# Altium schematic sheet sudoku.SchDoc
size 999 x 540 mm
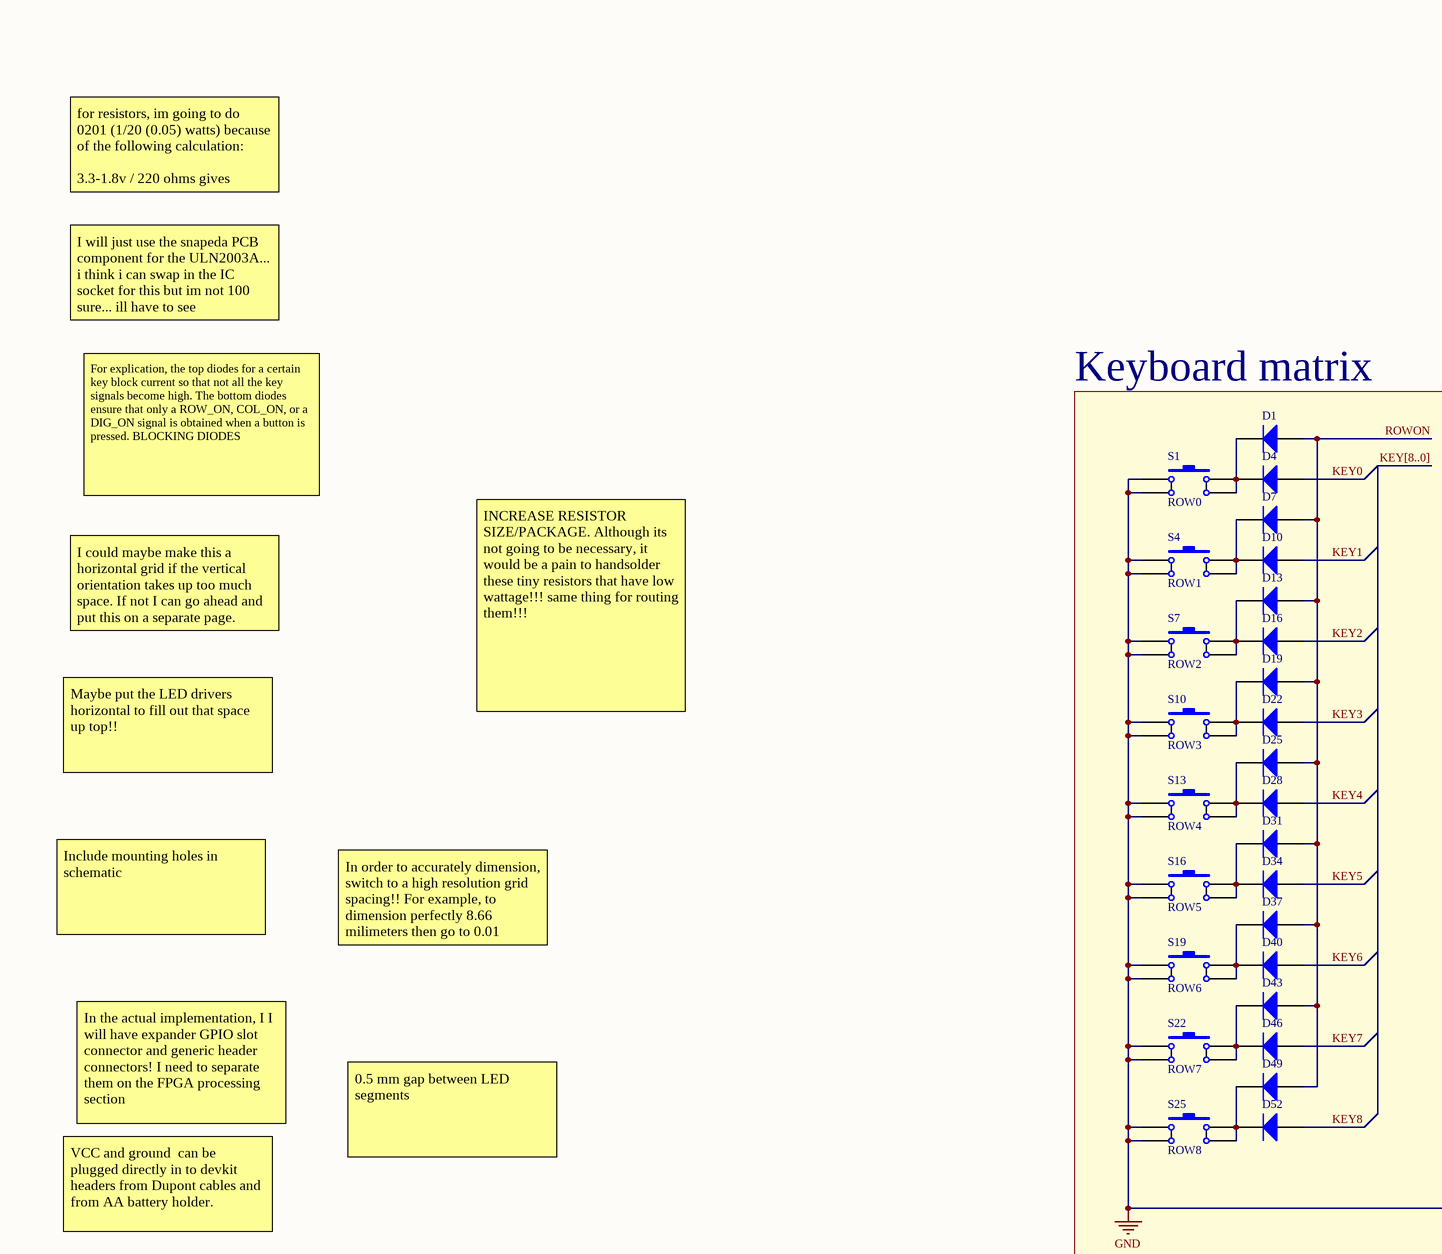
[diagram p0: sudoku.SchDoc, top left]
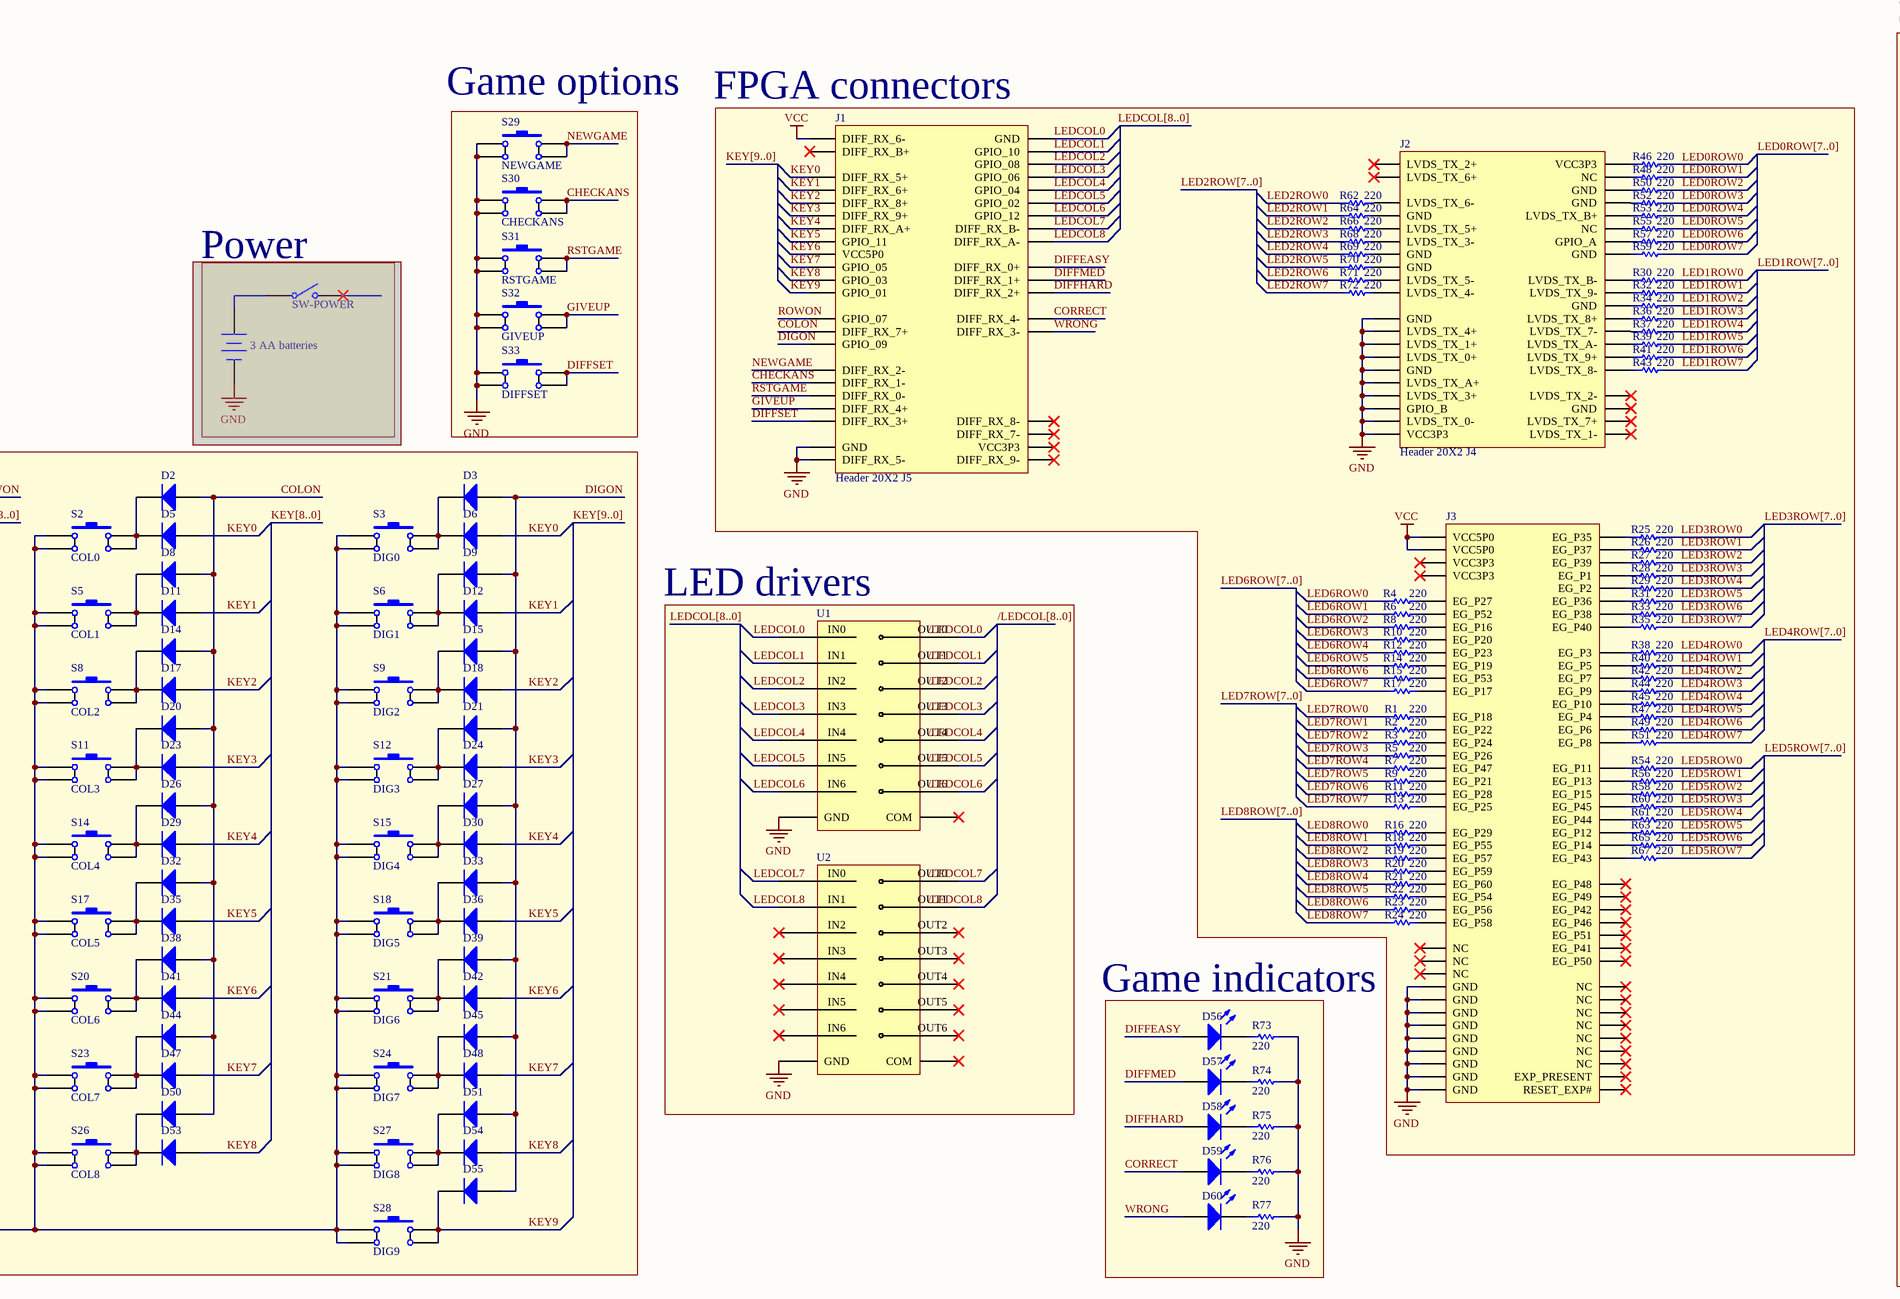
[diagram p1: sudoku.SchDoc, top middle]
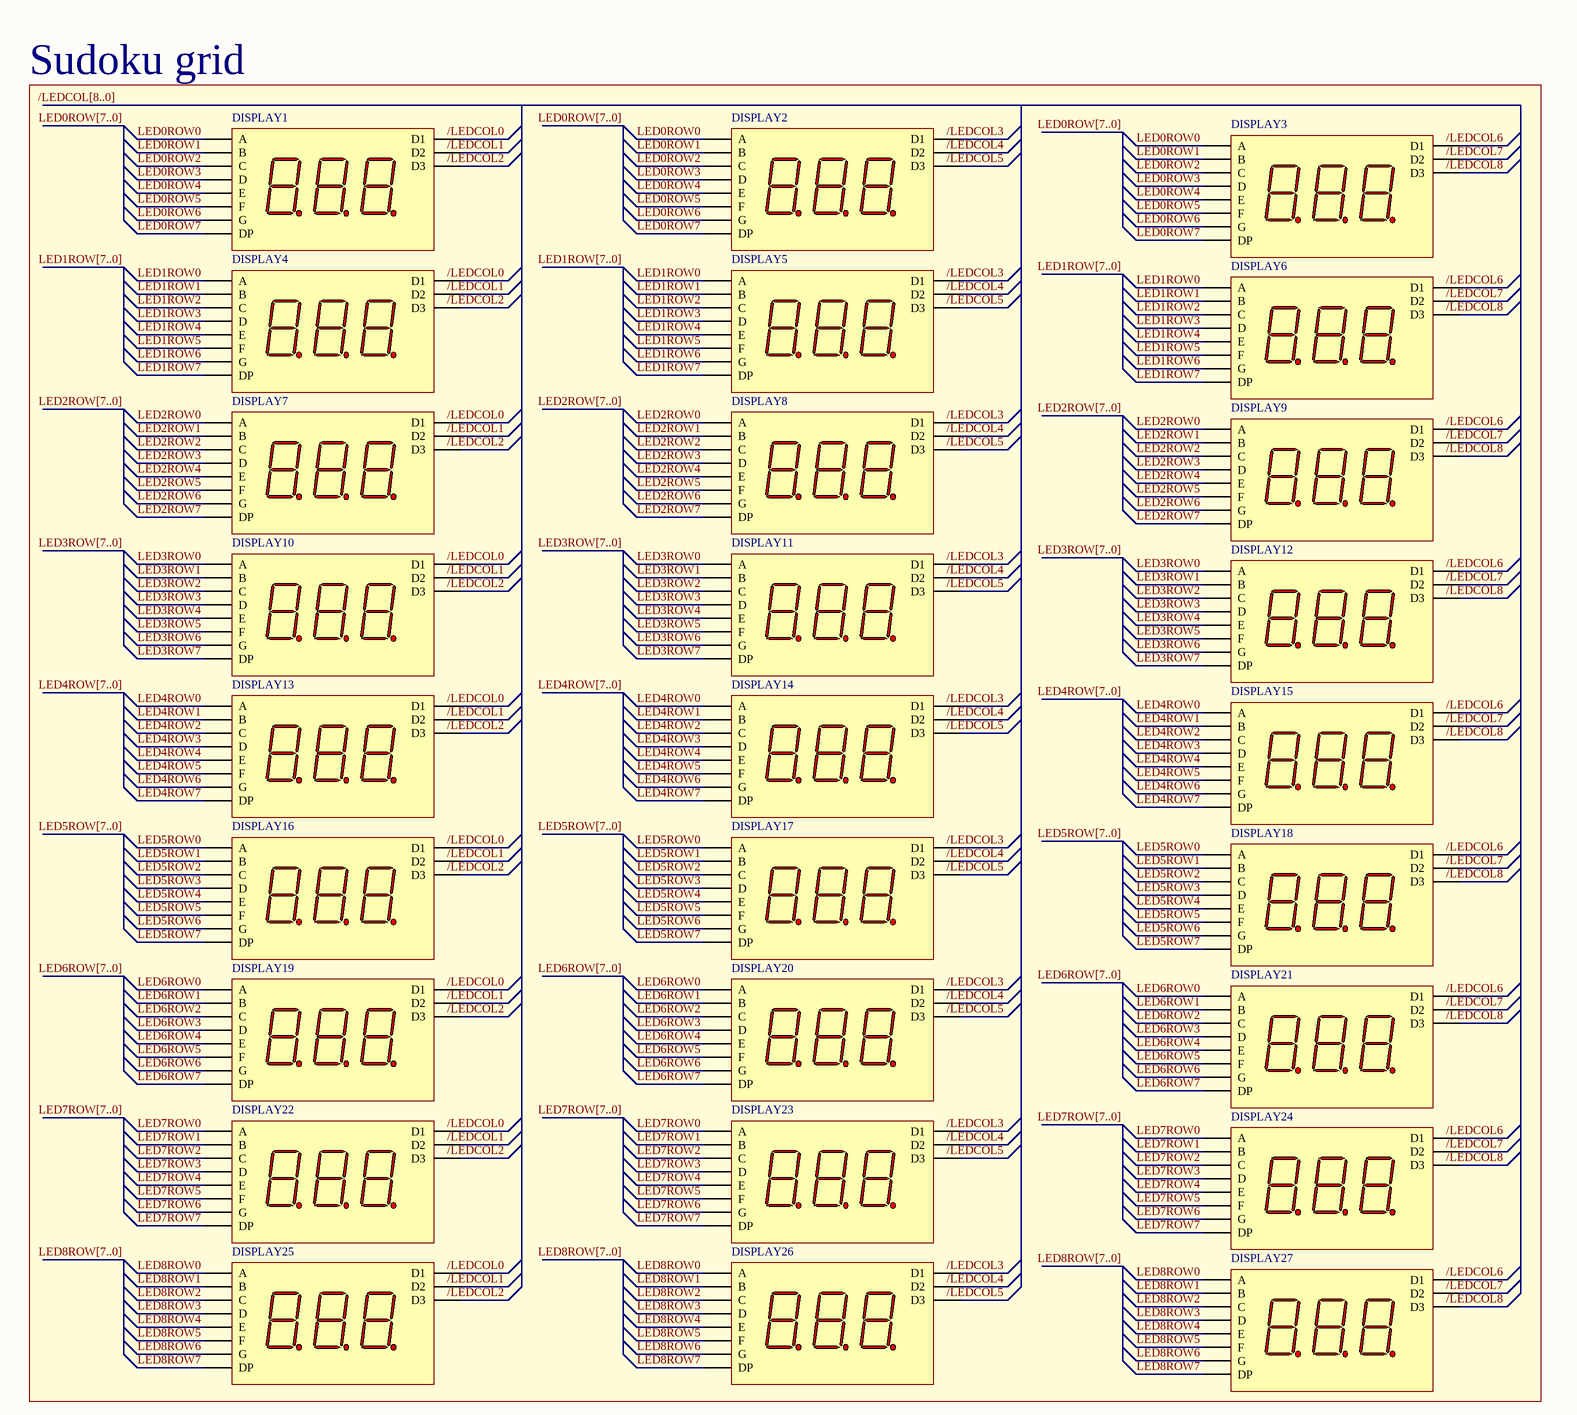
[diagram p2: sudoku.SchDoc, top right]
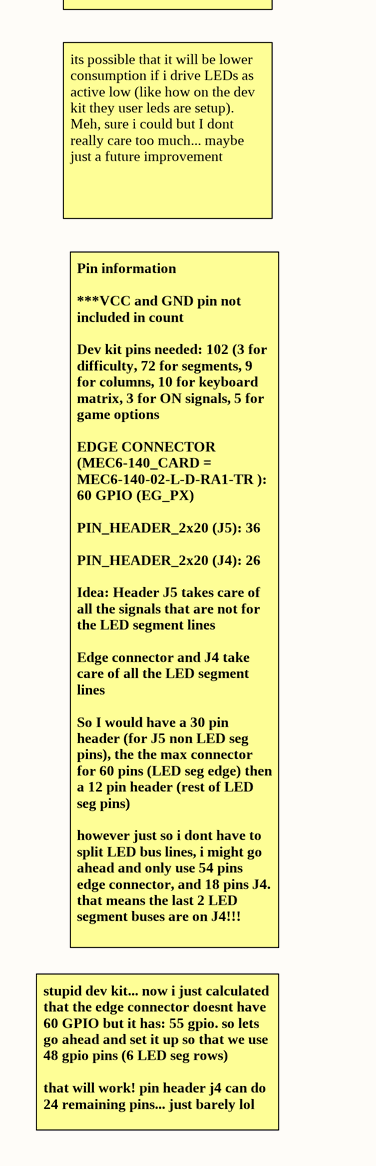
[diagram p3: sudoku.SchDoc, bottom left]
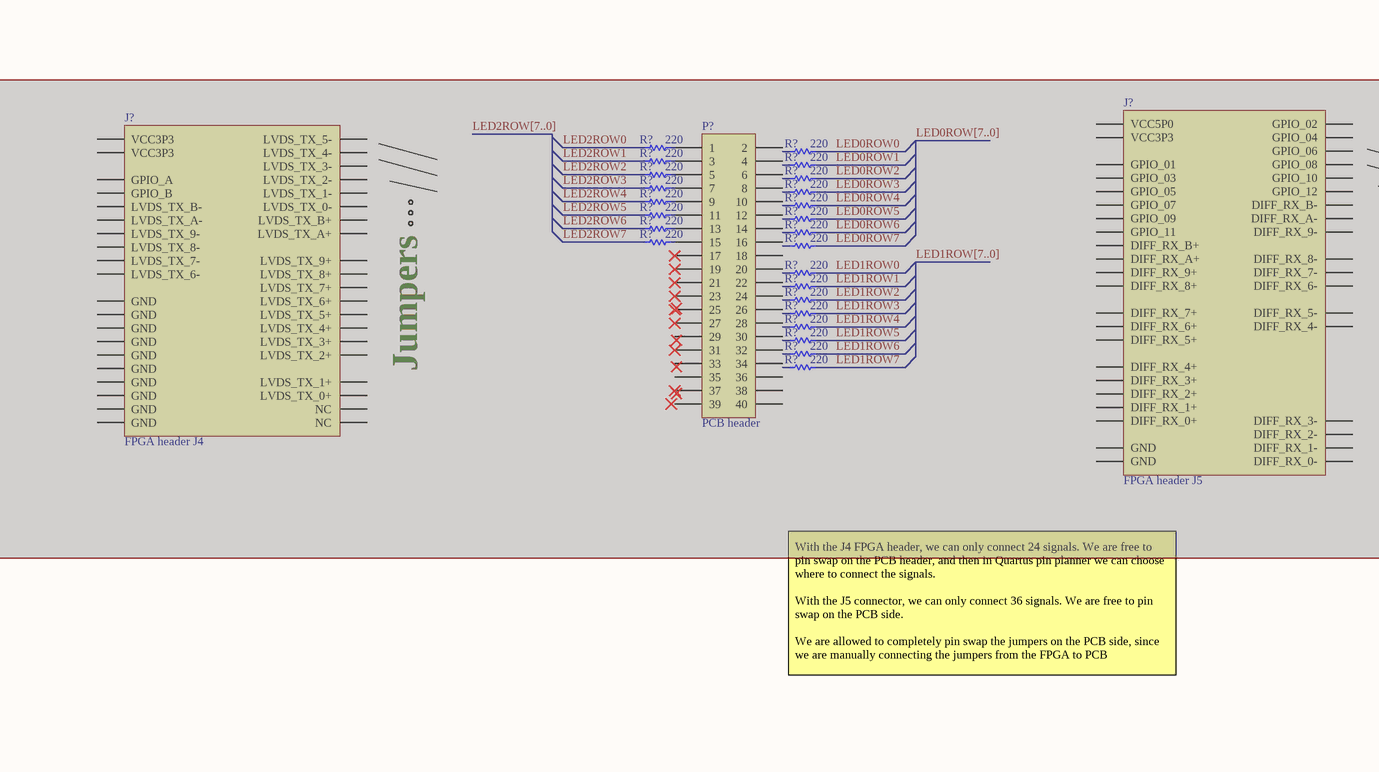
[diagram p4: sudoku.SchDoc, bottom middle]
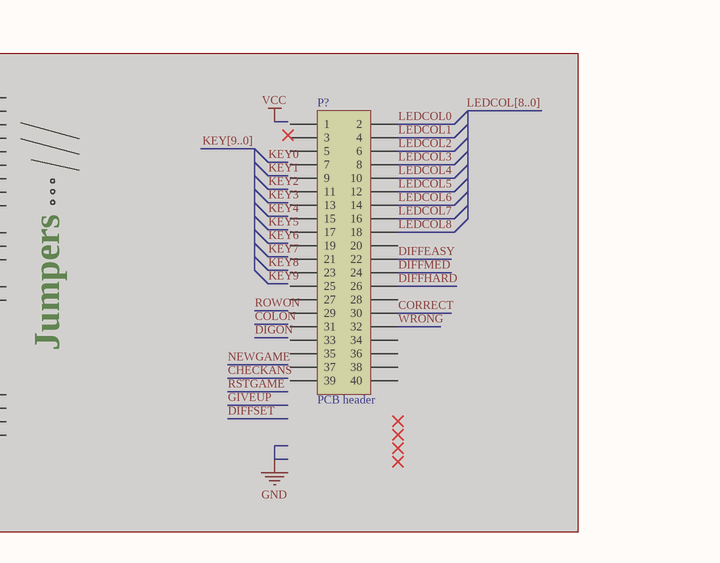
[diagram p5: sudoku.SchDoc, bottom right]

## Parts
(Parts that share a designator on the sheet are numbered #1, #2 ... from top to bottom, then left to right.)
BT?  3 AA batteries  [BAT-2]  (masked out: inside a compile mask, not in the netlist)
D1  Diode 1N4007  [DIODE_SMC]  (value not drawn)
D2  Diode 1N4007  [DIODE_SMC]  (value not drawn)
D3  Diode 1N4007  [DIODE_SMC]  (value not drawn)
D4  Diode 1N4007  [DIODE_SMC]  (value not drawn)
D5  Diode 1N4007  [DIODE_SMC]  (value not drawn)
D6  Diode 1N4007  [DIODE_SMC]  (value not drawn)
D7  Diode 1N4007  [DIODE_SMC]  (value not drawn)
D8  Diode 1N4007  [DIODE_SMC]  (value not drawn)
D9  Diode 1N4007  [DIODE_SMC]  (value not drawn)
D10  Diode 1N4007  [DIODE_SMC]  (value not drawn)
D11  Diode 1N4007  [DIODE_SMC]  (value not drawn)
D12  Diode 1N4007  [DIODE_SMC]  (value not drawn)
D13  Diode 1N4007  [DIODE_SMC]  (value not drawn)
D14  Diode 1N4007  [DIODE_SMC]  (value not drawn)
D15  Diode 1N4007  [DIODE_SMC]  (value not drawn)
D16  Diode 1N4007  [DIODE_SMC]  (value not drawn)
D17  Diode 1N4007  [DIODE_SMC]  (value not drawn)
D18  Diode 1N4007  [DIODE_SMC]  (value not drawn)
D19  Diode 1N4007  [DIODE_SMC]  (value not drawn)
D20  Diode 1N4007  [DIODE_SMC]  (value not drawn)
D21  Diode 1N4007  [DIODE_SMC]  (value not drawn)
D22  Diode 1N4007  [DIODE_SMC]  (value not drawn)
D23  Diode 1N4007  [DIODE_SMC]  (value not drawn)
D24  Diode 1N4007  [DIODE_SMC]  (value not drawn)
D25  Diode 1N4007  [DIODE_SMC]  (value not drawn)
D26  Diode 1N4007  [DIODE_SMC]  (value not drawn)
D27  Diode 1N4007  [DIODE_SMC]  (value not drawn)
D28  Diode 1N4007  [DIODE_SMC]  (value not drawn)
D29  Diode 1N4007  [DIODE_SMC]  (value not drawn)
D30  Diode 1N4007  [DIODE_SMC]  (value not drawn)
D31  Diode 1N4007  [DIODE_SMC]  (value not drawn)
D32  Diode 1N4007  [DIODE_SMC]  (value not drawn)
D33  Diode 1N4007  [DIODE_SMC]  (value not drawn)
D34  Diode 1N4007  [DIODE_SMC]  (value not drawn)
D35  Diode 1N4007  [DIODE_SMC]  (value not drawn)
D36  Diode 1N4007  [DIODE_SMC]  (value not drawn)
D37  Diode 1N4007  [DIODE_SMC]  (value not drawn)
D38  Diode 1N4007  [DIODE_SMC]  (value not drawn)
D39  Diode 1N4007  [DIODE_SMC]  (value not drawn)
D40  Diode 1N4007  [DIODE_SMC]  (value not drawn)
D41  Diode 1N4007  [DIODE_SMC]  (value not drawn)
D42  Diode 1N4007  [DIODE_SMC]  (value not drawn)
D43  Diode 1N4007  [DIODE_SMC]  (value not drawn)
D44  Diode 1N4007  [DIODE_SMC]  (value not drawn)
D45  Diode 1N4007  [DIODE_SMC]  (value not drawn)
D46  Diode 1N4007  [DIODE_SMC]  (value not drawn)
D47  Diode 1N4007  [DIODE_SMC]  (value not drawn)
D48  Diode 1N4007  [DIODE_SMC]  (value not drawn)
D49  Diode 1N4007  [DIODE_SMC]  (value not drawn)
D50  Diode 1N4007  [DIODE_SMC]  (value not drawn)
D51  Diode 1N4007  [DIODE_SMC]  (value not drawn)
D52  Diode 1N4007  [DIODE_SMC]  (value not drawn)
D53  Diode 1N4007  [DIODE_SMC]  (value not drawn)
D54  Diode 1N4007  [DIODE_SMC]  (value not drawn)
D55  Diode 1N4007  [DIODE_SMC]  (value not drawn)
D56  LED1  [RED]  (value not drawn)
D57  LED1  [RED]  (value not drawn)
D58  LED1  [RED]  (value not drawn)
D59  LED1  [green]  (value not drawn)
D60  LED1  [RED]  (value not drawn)
DISPLAY1  (no value)  [3DIGITDISPLAY]
DISPLAY2  (no value)  [3DIGITDISPLAY]
DISPLAY3  (no value)  [3DIGITDISPLAY]
DISPLAY4  (no value)  [3DIGITDISPLAY]
DISPLAY5  (no value)  [3DIGITDISPLAY]
DISPLAY6  (no value)  [3DIGITDISPLAY]
DISPLAY7  (no value)  [3DIGITDISPLAY]
DISPLAY8  (no value)  [3DIGITDISPLAY]
DISPLAY9  (no value)  [3DIGITDISPLAY]
DISPLAY10  (no value)  [3DIGITDISPLAY]
DISPLAY11  (no value)  [3DIGITDISPLAY]
DISPLAY12  (no value)  [3DIGITDISPLAY]
DISPLAY13  (no value)  [3DIGITDISPLAY]
DISPLAY14  (no value)  [3DIGITDISPLAY]
DISPLAY15  (no value)  [3DIGITDISPLAY]
DISPLAY16  (no value)  [3DIGITDISPLAY]
DISPLAY17  (no value)  [3DIGITDISPLAY]
DISPLAY18  (no value)  [3DIGITDISPLAY]
DISPLAY19  (no value)  [3DIGITDISPLAY]
DISPLAY20  (no value)  [3DIGITDISPLAY]
DISPLAY21  (no value)  [3DIGITDISPLAY]
DISPLAY22  (no value)  [3DIGITDISPLAY]
DISPLAY23  (no value)  [3DIGITDISPLAY]
DISPLAY24  (no value)  [3DIGITDISPLAY]
DISPLAY25  (no value)  [3DIGITDISPLAY]
DISPLAY26  (no value)  [3DIGITDISPLAY]
DISPLAY27  (no value)  [3DIGITDISPLAY]
J1  Header 20X2 J5  [2x20]
J2  Header 20X2 J4  [2x20]
J3  (no value)  [SAMTEC_MEC6-140-02-L-D-RA1-TR]
J?#1  FPGA header J4  [2x20]  (masked out: inside a compile mask, not in the netlist)
J?#2  FPGA header J5  [2x20]  (masked out: inside a compile mask, not in the netlist)
P?#1  PCB header  [HDR2X20]  (masked out: inside a compile mask, not in the netlist)
P?#2  PCB header  [HDR2X20]  (masked out: inside a compile mask, not in the netlist)
R1  value 220  [SMD-0805-RES]  (hidden comment: Res1)
R2  value 220  [SMD-0805-RES]  (hidden comment: Res1)
R3  value 220  [SMD-0805-RES]  (hidden comment: Res1)
R4  value 220  [SMD-0805-RES]  (hidden comment: Res1)
R5  value 220  [SMD-0805-RES]  (hidden comment: Res1)
R6  value 220  [SMD-0805-RES]  (hidden comment: Res1)
R7  value 220  [SMD-0805-RES]  (hidden comment: Res1)
R8  value 220  [SMD-0805-RES]  (hidden comment: Res1)
R9  value 220  [SMD-0805-RES]  (hidden comment: Res1)
R10  value 220  [SMD-0805-RES]  (hidden comment: Res1)
R11  value 220  [SMD-0805-RES]  (hidden comment: Res1)
R12  value 220  [SMD-0805-RES]  (hidden comment: Res1)
R13  value 220  [SMD-0805-RES]  (hidden comment: Res1)
R14  value 220  [SMD-0805-RES]  (hidden comment: Res1)
R15  value 220  [SMD-0805-RES]  (hidden comment: Res1)
R16  value 220  [SMD-0805-RES]  (hidden comment: Res1)
R17  value 220  [SMD-0805-RES]  (hidden comment: Res1)
R18  value 220  [SMD-0805-RES]  (hidden comment: Res1)
R19  value 220  [SMD-0805-RES]  (hidden comment: Res1)
R20  value 220  [SMD-0805-RES]  (hidden comment: Res1)
R21  value 220  [SMD-0805-RES]  (hidden comment: Res1)
R22  value 220  [SMD-0805-RES]  (hidden comment: Res1)
R23  value 220  [SMD-0805-RES]  (hidden comment: Res1)
R24  value 220  [SMD-0805-RES]  (hidden comment: Res1)
R25  value 220  [SMD-0805-RES]  (hidden comment: Res1)
R26  value 220  [SMD-0805-RES]  (hidden comment: Res1)
R27  value 220  [SMD-0805-RES]  (hidden comment: Res1)
R28  value 220  [SMD-0805-RES]  (hidden comment: Res1)
R29  value 220  [SMD-0805-RES]  (hidden comment: Res1)
R30  value 220  [SMD-0805-RES]  (hidden comment: Res1)
R31  value 220  [SMD-0805-RES]  (hidden comment: Res1)
R32  value 220  [SMD-0805-RES]  (hidden comment: Res1)
R33  value 220  [SMD-0805-RES]  (hidden comment: Res1)
R34  value 220  [SMD-0805-RES]  (hidden comment: Res1)
R35  value 220  [SMD-0805-RES]  (hidden comment: Res1)
R36  value 220  [SMD-0805-RES]  (hidden comment: Res1)
R37  value 220  [SMD-0805-RES]  (hidden comment: Res1)
R38  value 220  [SMD-0805-RES]  (hidden comment: Res1)
R39  value 220  [SMD-0805-RES]  (hidden comment: Res1)
R40  value 220  [SMD-0805-RES]  (hidden comment: Res1)
R41  value 220  [SMD-0805-RES]  (hidden comment: Res1)
R42  value 220  [SMD-0805-RES]  (hidden comment: Res1)
R43  value 220  [SMD-0805-RES]  (hidden comment: Res1)
R44  value 220  [SMD-0805-RES]  (hidden comment: Res1)
R45  value 220  [SMD-0805-RES]  (hidden comment: Res1)
R46  value 220  [SMD-0805-RES]  (hidden comment: Res1)
R47  value 220  [SMD-0805-RES]  (hidden comment: Res1)
R48  value 220  [SMD-0805-RES]  (hidden comment: Res1)
R49  value 220  [SMD-0805-RES]  (hidden comment: Res1)
R50  value 220  [SMD-0805-RES]  (hidden comment: Res1)
R51  value 220  [SMD-0805-RES]  (hidden comment: Res1)
R52  value 220  [SMD-0805-RES]  (hidden comment: Res1)
R53  value 220  [SMD-0805-RES]  (hidden comment: Res1)
R54  value 220  [SMD-0805-RES]  (hidden comment: Res1)
R55  value 220  [SMD-0805-RES]  (hidden comment: Res1)
R56  value 220  [SMD-0805-RES]  (hidden comment: Res1)
R57  value 220  [SMD-0805-RES]  (hidden comment: Res1)
R58  value 220  [SMD-0805-RES]  (hidden comment: Res1)
R59  value 220  [SMD-0805-RES]  (hidden comment: Res1)
R60  value 220  [SMD-0805-RES]  (hidden comment: Res1)
R61  value 220  [SMD-0805-RES]  (hidden comment: Res1)
R62  value 220  [SMD-0805-RES]  (hidden comment: Res1)
R63  value 220  [SMD-0805-RES]  (hidden comment: Res1)
R64  value 220  [SMD-0805-RES]  (hidden comment: Res1)
R65  value 220  [SMD-0805-RES]  (hidden comment: Res1)
R66  value 220  [SMD-0805-RES]  (hidden comment: Res1)
R67  value 220  [SMD-0805-RES]  (hidden comment: Res1)
R68  value 220  [SMD-0805-RES]  (hidden comment: Res1)
R69  value 220  [SMD-0805-RES]  (hidden comment: Res1)
R70  value 220  [SMD-0805-RES]  (hidden comment: Res1)
R71  value 220  [SMD-0805-RES]  (hidden comment: Res1)
R72  value 220  [SMD-0805-RES]  (hidden comment: Res1)
R73  value 220  [SMD-0805-RES]  (hidden comment: Res1)
R74  value 220  [SMD-0805-RES]  (hidden comment: Res1)
R75  value 220  [SMD-0805-RES]  (hidden comment: Res1)
R76  value 220  [SMD-0805-RES]  (hidden comment: Res1)
R77  value 220  [SMD-0805-RES]  (hidden comment: Res1)
R?#1  value 220  [SMD-0805-RES]  (hidden comment: Res1)  (masked out: inside a compile mask, not in the netlist)
R?#2  value 220  [SMD-0805-RES]  (hidden comment: Res1)  (masked out: inside a compile mask, not in the netlist)
R?#3  value 220  [SMD-0805-RES]  (hidden comment: Res1)  (masked out: inside a compile mask, not in the netlist)
R?#4  value 220  [SMD-0805-RES]  (hidden comment: Res1)  (masked out: inside a compile mask, not in the netlist)
R?#5  value 220  [SMD-0805-RES]  (hidden comment: Res1)  (masked out: inside a compile mask, not in the netlist)
R?#6  value 220  [SMD-0805-RES]  (hidden comment: Res1)  (masked out: inside a compile mask, not in the netlist)
R?#7  value 220  [SMD-0805-RES]  (hidden comment: Res1)  (masked out: inside a compile mask, not in the netlist)
R?#8  value 220  [SMD-0805-RES]  (hidden comment: Res1)  (masked out: inside a compile mask, not in the netlist)
R?#9  value 220  [SMD-0805-RES]  (hidden comment: Res1)  (masked out: inside a compile mask, not in the netlist)
R?#10  value 220  [SMD-0805-RES]  (hidden comment: Res1)  (masked out: inside a compile mask, not in the netlist)
R?#11  value 220  [SMD-0805-RES]  (hidden comment: Res1)  (masked out: inside a compile mask, not in the netlist)
R?#12  value 220  [SMD-0805-RES]  (hidden comment: Res1)  (masked out: inside a compile mask, not in the netlist)
R?#13  value 220  [SMD-0805-RES]  (hidden comment: Res1)  (masked out: inside a compile mask, not in the netlist)
R?#14  value 220  [SMD-0805-RES]  (hidden comment: Res1)  (masked out: inside a compile mask, not in the netlist)
R?#15  value 220  [SMD-0805-RES]  (hidden comment: Res1)  (masked out: inside a compile mask, not in the netlist)
R?#16  value 220  [SMD-0805-RES]  (hidden comment: Res1)  (masked out: inside a compile mask, not in the netlist)
R?#17  value 220  [SMD-0805-RES]  (hidden comment: Res1)  (masked out: inside a compile mask, not in the netlist)
R?#18  value 220  [SMD-0805-RES]  (hidden comment: Res1)  (masked out: inside a compile mask, not in the netlist)
R?#19  value 220  [SMD-0805-RES]  (hidden comment: Res1)  (masked out: inside a compile mask, not in the netlist)
R?#20  value 220  [SMD-0805-RES]  (hidden comment: Res1)  (masked out: inside a compile mask, not in the netlist)
R?#21  value 220  [SMD-0805-RES]  (hidden comment: Res1)  (masked out: inside a compile mask, not in the netlist)
R?#22  value 220  [SMD-0805-RES]  (hidden comment: Res1)  (masked out: inside a compile mask, not in the netlist)
R?#23  value 220  [SMD-0805-RES]  (hidden comment: Res1)  (masked out: inside a compile mask, not in the netlist)
R?#24  value 220  [SMD-0805-RES]  (hidden comment: Res1)  (masked out: inside a compile mask, not in the netlist)
S1  ROW0  [SW_1825910-6-4]
S2  COL0  [SW_1825910-6-4]
S3  DIG0  [SW_1825910-6-4]
S4  ROW1  [SW_1825910-6-4]
S5  COL1  [SW_1825910-6-4]
S6  DIG1  [SW_1825910-6-4]
S7  ROW2  [SW_1825910-6-4]
S8  COL2  [SW_1825910-6-4]
S9  DIG2  [SW_1825910-6-4]
S10  ROW3  [SW_1825910-6-4]
S11  COL3  [SW_1825910-6-4]
S12  DIG3  [SW_1825910-6-4]
S13  ROW4  [SW_1825910-6-4]
S14  COL4  [SW_1825910-6-4]
S15  DIG4  [SW_1825910-6-4]
S16  ROW5  [SW_1825910-6-4]
S17  COL5  [SW_1825910-6-4]
S18  DIG5  [SW_1825910-6-4]
S19  ROW6  [SW_1825910-6-4]
S20  COL6  [SW_1825910-6-4]
S21  DIG6  [SW_1825910-6-4]
S22  ROW7  [SW_1825910-6-4]
S23  COL7  [SW_1825910-6-4]
S24  DIG7  [SW_1825910-6-4]
S25  ROW8  [SW_1825910-6-4]
S26  COL8  [SW_1825910-6-4]
S27  DIG8  [SW_1825910-6-4]
S28  DIG9  [SW_1825910-6-4]
S29  NEWGAME  [SW_1825910-6-4]
S30  CHECKANS  [SW_1825910-6-4]
S31  RSTGAME  [SW_1825910-6-4]
S32  GIVEUP  [SW_1825910-6-4]
S33  DIFFSET  [SW_1825910-6-4]
S?  SW-POWER  [SPST-2]  (masked out: inside a compile mask, not in the netlist)
U1  (no value)  [DIL16]
U2  (no value)  [DIL16]

## Blocks framed on the sheet
Sudoku grid: DISPLAY1-DISPLAY27
FPGA connectors: J1-J3 R1-R72
Power: BT? S?
Keyboard matrix: D1-D55 S1-S28
LED drivers: U1 U2

## Nets
GND: J1.28(DIFF_RX_5-) J1.30(GND) J2.2(VCC3P3) J2.6(GPIO_B) J2.10(GND) J2.14(LVDS_TX_A+) J2.18(GND) J2.30(LVDS_TX_4+) J2.32(LVDS_TX_3+) J2.38(LVDS_TX_1+) J2.39(LVDS_TX_0-) J2.40(LVDS_TX_0+) J3.10(GND) J3.21(GND) J3.22(GND) J3.32(GND) J3.33(GND) J3.44(GND) J3.53(GND) J3.54(GND) J3.76(GND) R73.2 R74.2 R75.2 R76.2 R77.2 S1.3 S1.4 S2.3 S2.4 S3.3 S3.4 S4.3 S4.4 S5.3 S5.4 S6.3 S6.4 S7.3 S7.4 S8.3 S8.4 S9.3 S9.4 S10.3 S10.4 S11.3 S11.4 S12.3 S12.4 S13.3 S13.4 S14.3 S14.4 S15.3 S15.4 S16.3 S16.4 S17.3 S17.4 S18.3 S18.4 S19.3 S19.4 S20.3 S20.4 S21.3 S21.4 S22.3 S22.4 S23.3 S23.4 S24.3 S24.4 S25.3 S25.4 S26.3 S26.4 S27.3 S27.4 S28.3 S28.4 S29.3 S29.4 S30.3 S30.4 S31.3 S31.4 S32.3 S32.4 S33.3 S33.4 U1.8(GND) U2.8(GND)
VCC: J1.26(DIFF_RX_6-) J3.79(VCC5P0) J3.80(VCC5P0)
/LEDCOL0: DISPLAY1.12(D1) DISPLAY4.12(D1) DISPLAY7.12(D1) DISPLAY10.12(D1) DISPLAY13.12(D1) DISPLAY16.12(D1) DISPLAY19.12(D1) DISPLAY22.12(D1) DISPLAY25.12(D1) U1.16(IN0)
/LEDCOL1: DISPLAY1.9(D2) DISPLAY4.9(D2) DISPLAY7.9(D2) DISPLAY10.9(D2) DISPLAY13.9(D2) DISPLAY16.9(D2) DISPLAY19.9(D2) DISPLAY22.9(D2) DISPLAY25.9(D2) U1.15(IN1)
/LEDCOL2: DISPLAY1.8(D3) DISPLAY4.8(D3) DISPLAY7.8(D3) DISPLAY10.8(D3) DISPLAY13.8(D3) DISPLAY16.8(D3) DISPLAY19.8(D3) DISPLAY22.8(D3) DISPLAY25.8(D3) U1.14(IN2)
/LEDCOL3: DISPLAY2.12(D1) DISPLAY5.12(D1) DISPLAY8.12(D1) DISPLAY11.12(D1) DISPLAY14.12(D1) DISPLAY17.12(D1) DISPLAY20.12(D1) DISPLAY23.12(D1) DISPLAY26.12(D1) U1.13(IN3)
/LEDCOL4: DISPLAY2.9(D2) DISPLAY5.9(D2) DISPLAY8.9(D2) DISPLAY11.9(D2) DISPLAY14.9(D2) DISPLAY17.9(D2) DISPLAY20.9(D2) DISPLAY23.9(D2) DISPLAY26.9(D2) U1.12(IN4)
/LEDCOL5: DISPLAY2.8(D3) DISPLAY5.8(D3) DISPLAY8.8(D3) DISPLAY11.8(D3) DISPLAY14.8(D3) DISPLAY17.8(D3) DISPLAY20.8(D3) DISPLAY23.8(D3) DISPLAY26.8(D3) U1.11(IN5)
/LEDCOL6: DISPLAY3.12(D1) DISPLAY6.12(D1) DISPLAY9.12(D1) DISPLAY12.12(D1) DISPLAY15.12(D1) DISPLAY18.12(D1) DISPLAY21.12(D1) DISPLAY24.12(D1) DISPLAY27.12(D1) U1.10(IN6)
/LEDCOL7: DISPLAY3.9(D2) DISPLAY6.9(D2) DISPLAY9.9(D2) DISPLAY12.9(D2) DISPLAY15.9(D2) DISPLAY18.9(D2) DISPLAY21.9(D2) DISPLAY24.9(D2) DISPLAY27.9(D2) U2.16(IN0)
/LEDCOL8: DISPLAY3.8(D3) DISPLAY6.8(D3) DISPLAY9.8(D3) DISPLAY12.8(D3) DISPLAY15.8(D3) DISPLAY18.8(D3) DISPLAY21.8(D3) DISPLAY24.8(D3) DISPLAY27.8(D3) U2.15(IN1)
CHECKANS: J1.38(DIFF_RX_1-) S30.1 S30.2
COLON: D2.1(A) D8.1(A) D14.1(A) D20.1(A) D26.1(A) D32.1(A) D38.1(A) D44.1(A) D50.1(A) J1.23(DIFF_RX_7+)
CORRECT: D59.1(A) J1.32(DIFF_RX_4-)
DIFFEASY: D56.1(A) J1.39(DIFF_RX_0+)
DIFFHARD: D58.1(A) J1.35(DIFF_RX_2+)
DIFFMED: D57.1(A) J1.37(DIFF_RX_1+)
DIFFSET: J1.33(DIFF_RX_3+) S33.1 S33.2
DIGON: D3.1(A) D9.1(A) D15.1(A) D21.1(A) D27.1(A) D33.1(A) D39.1(A) D45.1(A) D51.1(A) D55.1(A) J1.9(GPIO_09)
GIVEUP: J1.31(DIFF_RX_4+) S32.1 S32.2
KEY0: D4.1(A) D5.1(A) D6.1(A) J1.27(DIFF_RX_5+)
KEY1: D10.1(A) D11.1(A) D12.1(A) J1.25(DIFF_RX_6+)
KEY2: D16.1(A) D17.1(A) D18.1(A) J1.21(DIFF_RX_8+)
KEY3: D22.1(A) D23.1(A) D24.1(A) J1.19(DIFF_RX_9+)
KEY4: D28.1(A) D29.1(A) D30.1(A) J1.17(DIFF_RX_A+)
KEY5: D34.1(A) D35.1(A) D36.1(A) J1.13(GPIO_11)
KEY6: D40.1(A) D41.1(A) D42.1(A) J1.11(VCC5P0)
KEY7: D46.1(A) D47.1(A) D48.1(A) J1.5(GPIO_05)
KEY8: D52.1(A) D53.1(A) D54.1(A) J1.3(GPIO_03)
KEY9: D55.2(K) J1.1(GPIO_01) S28.1 S28.2
LED0ROW0: DISPLAY1.11(A) DISPLAY2.11(A) DISPLAY3.11(A) R46.2
LED0ROW1: DISPLAY1.7(B) DISPLAY2.7(B) DISPLAY3.7(B) R48.2
LED0ROW2: DISPLAY1.4(C) DISPLAY2.4(C) DISPLAY3.4(C) R50.2
LED0ROW3: DISPLAY1.2(D) DISPLAY2.2(D) DISPLAY3.2(D) R52.2
LED0ROW4: DISPLAY1.1(E) DISPLAY2.1(E) DISPLAY3.1(E) R53.2
LED0ROW5: DISPLAY1.10(F) DISPLAY2.10(F) DISPLAY3.10(F) R55.2
LED0ROW6: DISPLAY1.5(G) DISPLAY2.5(G) DISPLAY3.5(G) R57.2
LED0ROW7: DISPLAY1.3(DP) DISPLAY2.3(DP) DISPLAY3.3(DP) R59.2
LED1ROW0: DISPLAY4.11(A) DISPLAY5.11(A) DISPLAY6.11(A) R30.2
LED1ROW1: DISPLAY4.7(B) DISPLAY5.7(B) DISPLAY6.7(B) R32.2
LED1ROW2: DISPLAY4.4(C) DISPLAY5.4(C) DISPLAY6.4(C) R34.2
LED1ROW3: DISPLAY4.2(D) DISPLAY5.2(D) DISPLAY6.2(D) R36.2
LED1ROW4: DISPLAY4.1(E) DISPLAY5.1(E) DISPLAY6.1(E) R37.2
LED1ROW5: DISPLAY4.10(F) DISPLAY5.10(F) DISPLAY6.10(F) R39.2
LED1ROW6: DISPLAY4.5(G) DISPLAY5.5(G) DISPLAY6.5(G) R41.2
LED1ROW7: DISPLAY4.3(DP) DISPLAY5.3(DP) DISPLAY6.3(DP) R43.2
LED2ROW0: DISPLAY7.11(A) DISPLAY8.11(A) DISPLAY9.11(A) R62.1
LED2ROW1: DISPLAY7.7(B) DISPLAY8.7(B) DISPLAY9.7(B) R64.1
LED2ROW2: DISPLAY7.4(C) DISPLAY8.4(C) DISPLAY9.4(C) R66.1
LED2ROW3: DISPLAY7.2(D) DISPLAY8.2(D) DISPLAY9.2(D) R68.1
LED2ROW4: DISPLAY7.1(E) DISPLAY8.1(E) DISPLAY9.1(E) R69.1
LED2ROW5: DISPLAY7.10(F) DISPLAY8.10(F) DISPLAY9.10(F) R70.1
LED2ROW6: DISPLAY7.5(G) DISPLAY8.5(G) DISPLAY9.5(G) R71.1
LED2ROW7: DISPLAY7.3(DP) DISPLAY8.3(DP) DISPLAY9.3(DP) R72.1
LED3ROW0: DISPLAY10.11(A) DISPLAY11.11(A) DISPLAY12.11(A) R25.2
LED3ROW1: DISPLAY10.7(B) DISPLAY11.7(B) DISPLAY12.7(B) R26.2
LED3ROW2: DISPLAY10.4(C) DISPLAY11.4(C) DISPLAY12.4(C) R27.2
LED3ROW3: DISPLAY10.2(D) DISPLAY11.2(D) DISPLAY12.2(D) R28.2
LED3ROW4: DISPLAY10.1(E) DISPLAY11.1(E) DISPLAY12.1(E) R29.2
LED3ROW5: DISPLAY10.10(F) DISPLAY11.10(F) DISPLAY12.10(F) R31.2
LED3ROW6: DISPLAY10.5(G) DISPLAY11.5(G) DISPLAY12.5(G) R33.2
LED3ROW7: DISPLAY10.3(DP) DISPLAY11.3(DP) DISPLAY12.3(DP) R35.2
LED4ROW0: DISPLAY13.11(A) DISPLAY14.11(A) DISPLAY15.11(A) R38.2
LED4ROW1: DISPLAY13.7(B) DISPLAY14.7(B) DISPLAY15.7(B) R40.2
LED4ROW2: DISPLAY13.4(C) DISPLAY14.4(C) DISPLAY15.4(C) R42.2
LED4ROW3: DISPLAY13.2(D) DISPLAY14.2(D) DISPLAY15.2(D) R44.2
LED4ROW4: DISPLAY13.1(E) DISPLAY14.1(E) DISPLAY15.1(E) R45.2
LED4ROW5: DISPLAY13.10(F) DISPLAY14.10(F) DISPLAY15.10(F) R47.2
LED4ROW6: DISPLAY13.5(G) DISPLAY14.5(G) DISPLAY15.5(G) R49.2
LED4ROW7: DISPLAY13.3(DP) DISPLAY14.3(DP) DISPLAY15.3(DP) R51.2
LED5ROW0: DISPLAY16.11(A) DISPLAY17.11(A) DISPLAY18.11(A) R54.2
LED5ROW1: DISPLAY16.7(B) DISPLAY17.7(B) DISPLAY18.7(B) R56.2
LED5ROW2: DISPLAY16.4(C) DISPLAY17.4(C) DISPLAY18.4(C) R58.2
LED5ROW3: DISPLAY16.2(D) DISPLAY17.2(D) DISPLAY18.2(D) R60.2
LED5ROW4: DISPLAY16.1(E) DISPLAY17.1(E) DISPLAY18.1(E) R61.2
LED5ROW5: DISPLAY16.10(F) DISPLAY17.10(F) DISPLAY18.10(F) R63.2
LED5ROW6: DISPLAY16.5(G) DISPLAY17.5(G) DISPLAY18.5(G) R65.2
LED5ROW7: DISPLAY16.3(DP) DISPLAY17.3(DP) DISPLAY18.3(DP) R67.2
LED6ROW0: DISPLAY19.11(A) DISPLAY20.11(A) DISPLAY21.11(A) R4.1
LED6ROW1: DISPLAY19.7(B) DISPLAY20.7(B) DISPLAY21.7(B) R6.1
LED6ROW2: DISPLAY19.4(C) DISPLAY20.4(C) DISPLAY21.4(C) R8.1
LED6ROW3: DISPLAY19.2(D) DISPLAY20.2(D) DISPLAY21.2(D) R10.1
LED6ROW4: DISPLAY19.1(E) DISPLAY20.1(E) DISPLAY21.1(E) R12.1
LED6ROW5: DISPLAY19.10(F) DISPLAY20.10(F) DISPLAY21.10(F) R14.1
LED6ROW6: DISPLAY19.5(G) DISPLAY20.5(G) DISPLAY21.5(G) R15.1
LED6ROW7: DISPLAY19.3(DP) DISPLAY20.3(DP) DISPLAY21.3(DP) R17.1
LED7ROW0: DISPLAY22.11(A) DISPLAY23.11(A) DISPLAY24.11(A) R1.1
LED7ROW1: DISPLAY22.7(B) DISPLAY23.7(B) DISPLAY24.7(B) R2.1
LED7ROW2: DISPLAY22.4(C) DISPLAY23.4(C) DISPLAY24.4(C) R3.1
LED7ROW3: DISPLAY22.2(D) DISPLAY23.2(D) DISPLAY24.2(D) R5.1
LED7ROW4: DISPLAY22.1(E) DISPLAY23.1(E) DISPLAY24.1(E) R7.1
LED7ROW5: DISPLAY22.10(F) DISPLAY23.10(F) DISPLAY24.10(F) R9.1
LED7ROW6: DISPLAY22.5(G) DISPLAY23.5(G) DISPLAY24.5(G) R11.1
LED7ROW7: DISPLAY22.3(DP) DISPLAY23.3(DP) DISPLAY24.3(DP) R13.1
LED8ROW0: DISPLAY25.11(A) DISPLAY26.11(A) DISPLAY27.11(A) R16.1
LED8ROW1: DISPLAY25.7(B) DISPLAY26.7(B) DISPLAY27.7(B) R18.1
LED8ROW2: DISPLAY25.4(C) DISPLAY26.4(C) DISPLAY27.4(C) R19.1
LED8ROW3: DISPLAY25.2(D) DISPLAY26.2(D) DISPLAY27.2(D) R20.1
LED8ROW4: DISPLAY25.1(E) DISPLAY26.1(E) DISPLAY27.1(E) R21.1
LED8ROW5: DISPLAY25.10(F) DISPLAY26.10(F) DISPLAY27.10(F) R22.1
LED8ROW6: DISPLAY25.5(G) DISPLAY26.5(G) DISPLAY27.5(G) R23.1
LED8ROW7: DISPLAY25.3(DP) DISPLAY26.3(DP) DISPLAY27.3(DP) R24.1
LEDCOL0: J1.12(GND) U1.1(IN0)
LEDCOL1: J1.10(GPIO_10) U1.2(IN1)
LEDCOL2: J1.8(GPIO_08) U1.3(IN2)
LEDCOL3: J1.6(GPIO_06) U1.4(IN3)
LEDCOL4: J1.4(GPIO_04) U1.5(IN4)
LEDCOL5: J1.2(GPIO_02) U1.6(IN5)
LEDCOL6: J1.14(GPIO_12) U1.7(IN6)
LEDCOL7: J1.16(DIFF_RX_B-) U2.1(IN0)
LEDCOL8: J1.18(DIFF_RX_A-) U2.2(IN1)
NEWGAME: J1.36(DIFF_RX_2-) S29.1 S29.2
ROWON: D1.1(A) D7.1(A) D13.1(A) D19.1(A) D25.1(A) D31.1(A) D37.1(A) D43.1(A) D49.1(A) J1.7(GPIO_07)
RSTGAME: J1.40(DIFF_RX_0-) S31.1 S31.2
WRONG: D60.1(A) J1.34(DIFF_RX_3-)
NetD1_2: D1.2(K) D4.2(K) S1.1 S1.2
NetD2_2: D2.2(K) D5.2(K) S2.1 S2.2
NetD3_2: D3.2(K) D6.2(K) S3.1 S3.2
NetD7_2: D7.2(K) D10.2(K) S4.1 S4.2
NetD8_2: D8.2(K) D11.2(K) S5.1 S5.2
NetD9_2: D9.2(K) D12.2(K) S6.1 S6.2
NetD13_2: D13.2(K) D16.2(K) S7.1 S7.2
NetD14_2: D14.2(K) D17.2(K) S8.1 S8.2
NetD15_2: D15.2(K) D18.2(K) S9.1 S9.2
NetD19_2: D19.2(K) D22.2(K) S10.1 S10.2
NetD20_2: D20.2(K) D23.2(K) S11.1 S11.2
NetD21_2: D21.2(K) D24.2(K) S12.1 S12.2
NetD25_2: D25.2(K) D28.2(K) S13.1 S13.2
NetD26_2: D26.2(K) D29.2(K) S14.1 S14.2
NetD27_2: D27.2(K) D30.2(K) S15.1 S15.2
NetD31_2: D31.2(K) D34.2(K) S16.1 S16.2
NetD32_2: D32.2(K) D35.2(K) S17.1 S17.2
NetD33_2: D33.2(K) D36.2(K) S18.1 S18.2
NetD37_2: D37.2(K) D40.2(K) S19.1 S19.2
NetD38_2: D38.2(K) D41.2(K) S20.1 S20.2
NetD39_2: D39.2(K) D42.2(K) S21.1 S21.2
NetD43_2: D43.2(K) D46.2(K) S22.1 S22.2
NetD44_2: D44.2(K) D47.2(K) S23.1 S23.2
NetD45_2: D45.2(K) D48.2(K) S24.1 S24.2
NetD49_2: D49.2(K) D52.2(K) S25.1 S25.2
NetD50_2: D50.2(K) D53.2(K) S26.1 S26.2
NetD51_2: D51.2(K) D54.2(K) S27.1 S27.2
NetD56_2: D56.2(K) R73.1
NetD57_2: D57.2(K) R74.1
NetD58_2: D58.2(K) R75.1
NetD59_2: D59.2(K) R76.1
NetD60_2: D60.2(K) R77.1
NetJ2_1: J2.1(VCC3P3) R46.1
NetJ2_3: J2.3(NC) R55.1
NetJ2_4: J2.4(NC) R48.1
NetJ2_5: J2.5(GPIO_A) R57.1
NetJ2_7: J2.7(GND) R59.1
NetJ2_8: J2.8(GND) R50.1
NetJ2_9: J2.9(GND) R52.1
NetJ2_11: J2.11(LVDS_TX_B-) R30.1
NetJ2_12: J2.12(LVDS_TX_B+) R53.1
NetJ2_13: J2.13(LVDS_TX_A-) R39.1
NetJ2_15: J2.15(LVDS_TX_9-) R32.1
NetJ2_16: J2.16(LVDS_TX_9+) R41.1
NetJ2_17: J2.17(GND) R34.1
NetJ2_19: J2.19(LVDS_TX_8-) R43.1
NetJ2_20: J2.20(LVDS_TX_8+) R36.1
NetJ2_21: J2.21(LVDS_TX_7-) R37.1
NetJ2_23: J2.23(LVDS_TX_6-) R62.2
NetJ2_25: J2.25(GND) R70.2
NetJ2_26: J2.26(GND) R64.2
NetJ2_27: J2.27(LVDS_TX_5-) R71.2
NetJ2_28: J2.28(LVDS_TX_5+) R66.2
NetJ2_29: J2.29(LVDS_TX_4-) R72.2
NetJ2_31: J2.31(LVDS_TX_3-) R68.2
NetJ2_33: J2.33(GND) R69.2
NetJ3_05: J3.05(EG_P1) R28.1
NetJ3_06: J3.06(EG_P35) R25.1
NetJ3_07: J3.07(EG_P2) R29.1
NetJ3_08: J3.08(EG_P36) R31.1
NetJ3_09: J3.09(EG_P3) R38.1
NetJ3_11: J3.11(EG_P4) R47.1
NetJ3_12: J3.12(EG_P37) R26.1
NetJ3_13: J3.13(EG_P5) R40.1
NetJ3_14: J3.14(EG_P38) R33.1
NetJ3_15: J3.15(EG_P6) R49.1
NetJ3_16: J3.16(EG_P39) R27.1
NetJ3_17: J3.17(EG_P7) R42.1
NetJ3_18: J3.18(EG_P40) R35.1
NetJ3_19: J3.19(EG_P8) R51.1
NetJ3_23: J3.23(EG_P9) R44.1
NetJ3_25: J3.25(EG_P10) R45.1
NetJ3_26: J3.26(EG_P43) R67.1
NetJ3_27: J3.27(EG_P11) R54.1
NetJ3_28: J3.28(EG_P44) R61.1
NetJ3_29: J3.29(EG_P12) R63.1
NetJ3_30: J3.30(EG_P45) R60.1
NetJ3_31: J3.31(EG_P13) R56.1
NetJ3_35: J3.35(EG_P14) R65.1
NetJ3_36: J3.36(EG_P47) R7.2
NetJ3_37: J3.37(EG_P15) R58.1
NetJ3_39: J3.39(EG_P16) R8.2
NetJ3_41: J3.41(EG_P17) R17.2
NetJ3_43: J3.43(EG_P18) R1.2
NetJ3_45: J3.45(EG_P19) R14.2
NetJ3_47: J3.47(EG_P20) R10.2
NetJ3_48: J3.48(EG_P52) R6.2
NetJ3_49: J3.49(EG_P21) R9.2
NetJ3_50: J3.50(EG_P53) R15.2
NetJ3_51: J3.51(EG_P22) R2.2
NetJ3_52: J3.52(EG_P54) R22.2
NetJ3_55: J3.55(EG_P23) R12.2
NetJ3_56: J3.56(EG_P55) R18.2
NetJ3_57: J3.57(EG_P24) R3.2
NetJ3_58: J3.58(EG_P56) R23.2
NetJ3_59: J3.59(EG_P25) R13.2
NetJ3_60: J3.60(EG_P57) R19.2
NetJ3_61: J3.61(EG_P26) R5.2
NetJ3_62: J3.62(EG_P58) R24.2
NetJ3_63: J3.63(EG_P27) R4.2
NetJ3_64: J3.64(EG_P59) R20.2
NetJ3_65: J3.65(EG_P28) R11.2
NetJ3_66: J3.66(EG_P60) R21.2
NetJ3_67: J3.67(EG_P29) R16.2

Not connected (* = marked no-connect by the designer): J1 15(DIFF_RX_B+)* 20(DIFF_RX_9-)* 22(DIFF_RX_8-)* 24(DIFF_RX_7-)* 29(VCC3P3)*; J2 22(LVDS_TX_7+)* 24(LVDS_TX_6+)* 34(GND)* 35(LVDS_TX_2-)* 36(LVDS_TX_2+)* 37(LVDS_TX_1-)*; J3 01(VCC3P3)* 02(VCC3P3)* 03(RESET_EXP#)* 04(NC)* 20(EG_P41)* 24(EG_P42)* 34(EG_P46)* 38(EG_P48)* 40(EG_P49)* 42(EG_P50)* 46(EG_P51)* 68(NC)* 69(NC)* 70(NC)* 71(NC)* 72(NC)* 73(NC)* 74(NC)* 75(NC)* 77(NC)* 78(EXP_PRESENT)*; U1 9(COM)*; U2 3(IN2)* 4(IN3)* 5(IN4)* 6(IN5)* 7(IN6)* 9(COM)* 10(IN6)* 11(IN5)* 12(IN4)* 13(IN3)* 14(IN2)*

## Buses and harness runs
bus /LEDCOL[8..0]
bus KEY[8..0]
bus KEY[9..0]
bus LED0ROW[7..0]
bus LED1ROW[7..0]
bus LED2ROW[7..0]
bus LED3ROW[7..0]
bus LED4ROW[7..0]
bus LED5ROW[7..0]
bus LED6ROW[7..0]
bus LED7ROW[7..0]
bus LED8ROW[7..0]
bus LEDCOL[8..0]

## Notes on the sheet
- (near S29) Game options
- for resistors, im going to do
  0201 (1/20 (0.05) watts) because of the following calculation:
  3.3-1.8v / 220 ohms gives roughly 6 mA. 0.006^2 x 220 is less than 0.05 watts!! by a fair amt
- I will just use the snapeda PCB component for the ULN2003A... i think i can swap in the IC socket for this but im not 100 sure... ill have to see
- For explication, the top diodes for a certain key block current so that not all the key signals become high. The bottom diodes ensure that only a ROW_ON, COL_ON, or a DIG_ON signal is obtained when a button is pressed. BLOCKING DIODES
- I could maybe make this a horizontal grid if the vertical orientation takes up too much space. If not I can go ahead and put this on a separate page.
- INCREASE RESISTOR SIZE/PACKAGE. Although its not going to be necessary, it would be a pain to handsolder these tiny resistors that have low wattage!!! same thing for routing them!!!
- Maybe put the LED drivers horizontal to fill out that space up top!!
- Include mounting holes in schematic
- In order to accurately dimension, switch to a high resolution grid spacing!! For example, to dimension perfectly 8.66 milimeters then go to 0.01 milimeter spacing. This will be compatible with all other dimensions
- Game indicators
- In the actual implementation, I I will have expander GPIO slot connector and generic header connectors! I need to separate them on the FPGA processing section
- 0.5 mm gap between LED segments
- VCC and ground  can be plugged directly in to devkit headers from Dupont cables and from AA battery holder.
  Or I could buy a proper 4.5mm 1.3mm power jack, that way i have proper diode protection for reverse polarization. In any case, I can just connect directly to a power pin VCC 5P0! I dont need to specify that in the schematic.... hmmm maybe its not worth even showing that ? not sure
- its possible that it will be lower consumption if i drive LEDs as active low (like how on the dev kit they user leds are setup). Meh, sure i could but I dont really care too much... maybe just a future improvement
- (near J?#1) Jumpers
- (near J?#2) Jumpers
- With the J4 FPGA header, we can only connect 24 signals. We are free to pin swap on the PCB header, and then in Quartus pin planner we can choose where to connect the signals.
  With the J5 connector, we can only connect 36 signals. We are free to pin swap on the PCB side.
  We are allowed to completely pin swap the jumpers on the PCB side, since we are manually connecting the jumpers from the FPGA to PCB
- Pin information
  ***VCC and GND pin not included in count
  Dev kit pins needed: 102 (3 for difficulty, 72 for segments, 9 for columns, 10 for keyboard matrix, 3 for ON signals, 5 for game options
  EDGE CONNECTOR (MEC6-140_CARD =
  MEC6-140-02-L-D-RA1-TR ): 60 GPIO (EG_PX)
  PIN_HEADER_2x20 (J5): 36
  PIN_HEADER_2x20 (J4): 26
  Idea: Header J5 takes care of all the signals that are not for the LED segment lines
  Edge connector and J4 take care of all the LED segment lines
  So I would have a 30 pin header (for J5 non LED seg pins), the the max connector for 60 pins (LED seg edge) then a 12 pin header (rest of LED seg pins)
  however just so i dont have to split LED bus lines, i might go ahead and only use 54 pins edge connector, and 18 pins J4. that means the last 2 LED segment buses are on J4!!!
  well in any case the simplest solution would be to use 2x20 pin headers that would be placed in parallel to the max 10 FPGA dev kit on the appropiate sides!!!! i dont have to use all the pins and i can pit disconnected for the ones that arent relavantes. advantage of this is that i can have access to the GPIO pins if i want to add more functionality...
- stupid dev kit... now i just calculated that the edge connector doesnt have 60 GPIO but it has: 55 gpio. so lets go ahead and set it up so that we use 48 gpio pins (6 LED seg rows)
  that will work! pin header j4 can do 24 remaining pins... just barely lol
- (in symbol ULN2003A) OUT0; OUT1; OUT2; OUT3; OUT4; OUT5; OUT6

## Library data of the parts
BT? = Battery: Multicell Battery; Published: 24-Mar-1999; LatestRevisionDate: 17-Jul-2002; LatestRevisionNote: Re-released for DXP Platform.; PackageReference: BAT-2; Publisher: Altium Limited; PackageDescription: Battery; 2 Leads
D1-D55 = Diode 1N4007: 1 Amp General Purpose Rectifier; Published: 8-Jun-2000; LatestRevisionDate: 17-Jul-2002; LatestRevisionNote: Re-released for DXP Platform.; DatasheetVersion: 1998; PackageVersion: Aug-1999; PackageReference: DO-41; Publisher: Altium Limited; PackageDescription: Diode, Axial; Body 5.2 x 2.7 mm (LxDia. max), Lead Dia. 0.86 mm (max); Code_JEDEC: DO-204-AL; ComponentLink1Description: Manufacturer Link; ComponentLink1URL: http://www.fairchildsemi.com/; ComponentLink2Description: Datasheet; ComponentLink2URL: http://www.fairchildsemi.com/ds/1N%2F1N4001.pdf
D56-D60 = LED1: Typical RED GaAs LED; Published: 8-Jun-2000; LatestRevisionDate: 08-Jul-2005; LatestRevisionNote: Mech Layer 1 removed.; PackageReference: LED-1; Publisher: Altium Limited; PackageDescription: LED; 2 Leads
DISPLAY1 = 3DIGITREDCC: 7-Segment Display; MinimumIntensity: 360 ucd; Note: Pins 1 and 6 are redundant Cathodes.; Published: 8-Jun-2000; LatestRevisionDate: 17-Dec-2003; LatestRevisionNote: Schematic revised, PCB Footprint replaced.; DatasheetVersion: 19-Feb-2002; PackageVersion: 11-Feb-2002; PackageReference: A; Publisher: Altium Limited; PackageDescription: LED, 7-Segment Display, 7.62 mm, RHD; 10 Leads; Row Space 5.08 mm; Pitch 2.54 mm; Colour: High Efficiency Red (HER); ComponentLink1Description: Manufacturer Link; ComponentLink1URL: http://www.agilent.com/
DISPLAY2-DISPLAY27 = 3DIGITREDCC: 7.62 mm Black Surface HER 7-Segment Display: CC, RH DP; MinimumIntensity: 360 ucd; Note: Pins 1 and 6 are redundant Cathodes.; Published: 8-Jun-2000; LatestRevisionDate: 17-Dec-2003; LatestRevisionNote: Schematic revised, PCB Footprint replaced.; DatasheetVersion: 19-Feb-2002; PackageVersion: 11-Feb-2002; PackageReference: A; Publisher: Altium Limited; PackageDescription: LED, 7-Segment Display, 7.62 mm, RHD; 10 Leads; Row Space 5.08 mm; Pitch 2.54 mm; Colour: High Efficiency Red (HER); ComponentLink1Description: Manufacturer Link; ComponentLink1URL: http://www.agilent.com/
J1 J?#2 = Header 20X2 J5: Header, 20-Pin, Dual row; LatestRevisionDate: 17-Jul-2002; LatestRevisionNote: Re-released for DXP Platform.; Publisher: Altium Limited
J2 J?#1 = Header 20X2 J4: Header, 20-Pin, Dual row; LatestRevisionDate: 17-Jul-2002; LatestRevisionNote: Re-released for DXP Platform.; Publisher: Altium Limited
J3 = MEC6-140-02-L-D-RA1-TR: Edge connector; MF: Samtec; Price: None; Availability: Unavailable; Package: None; Value: *; MP: MEC6-140-02-L-D-RA1-TR
P?#1 P?#2 = Header 20X2: Header, 20-Pin, Dual row; LatestRevisionDate: 17-Jul-2002; LatestRevisionNote: Re-released for DXP Platform.; Publisher: Altium Limited
R1-R77 R?#1-R?#24 = Res1: Resistor; Published: 8-Jun-2000; LatestRevisionDate: 17-Jul-2002; LatestRevisionNote: Re-released for DXP Platform.; PackageReference: AXIAL-0.3; Publisher: Altium Limited; PackageDescription: Axial Device, Thru-Hole; 2 Leads; 0.3 in Pin Spacing
S1-S33 = SW-PB: Switch; Published: 24-Mar-1999; LatestRevisionDate: 17-Jul-2002; LatestRevisionNote: Re-released for DXP Platform.; PackageReference: SPST-2; Publisher: Altium Limited; PackageDescription: Switch; 2 Leads
S? = SW-SPST: Single-Pole, Single-Throw Switch; Published: 24-Mar-1999; LatestRevisionDate: 17-Jul-2002; LatestRevisionNote: Re-released for DXP Platform.; PackageReference: SPST-2; Publisher: Altium Limited; PackageDescription: Switch; 2 Leads
U1 U2 = ULN2003A